# Altium schematic sheet Control_Interface.SchDoc
size A4; SheetNumber: 22; SheetTotal: 36
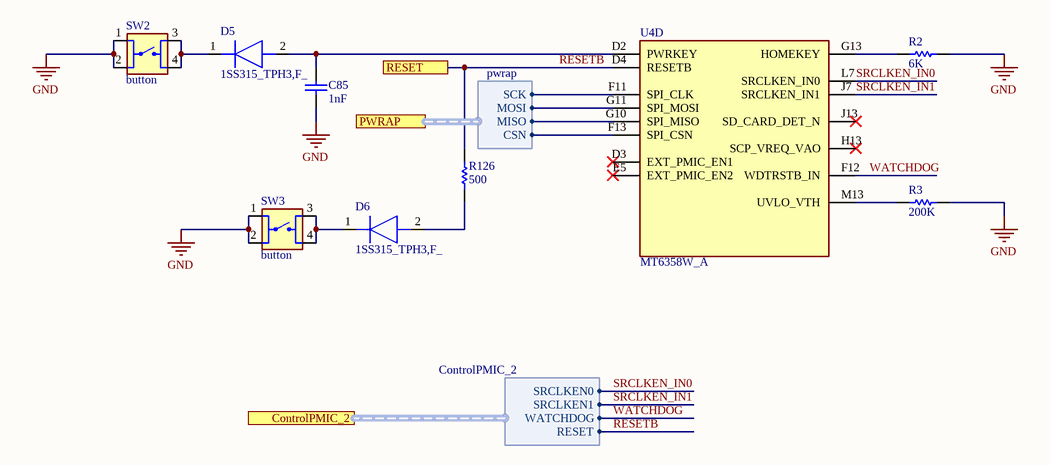
[diagram p0: Control_Interface.SchDoc]

## Parts
C85  value 1nF  [C0603]  (hidden comment: C0603)
D5  1SS315_TPH3,F_  [SOD2513X110N]
D6  1SS315_TPH3,F_  [SOD2513X110N]
R2  value 6K  [R0603]  (hidden comment: R0603)
R3  value 200K  [R0603]  (hidden comment: R0603)
R126  value 500  [R0603]  (hidden comment: R0603)
SW2  button  [BUTTON]
SW3  button  [BUTTON]
U4  MT6358W_A  [BGA194C40P16X15_640X600X66]  (part D of 6)

## Ports
ControlPMIC_2 (harness ControlPMIC_2, see Power[9700,8000], MT8365[11000,4800], MT8365_Other[1000,3700], Power[9700,9000]), PWRAP (harness pwrap, see Power[9100,8000], MT8365[5500,9000], MT8365_CONN[4500,8700], Power[9100,9000]), RESET (see Power[10000,7100], Power[11300,7100], RTL8201F[12800,5800], UART[1500,3000])

## Harnesses
pwrap: SCK, MOSI, MISO, CSN
ControlPMIC_2: WATCHDOG, SRCLKEN0, SRCLKEN1, RESET

## Nets
GND: C85.1 R2.2 R3.2 SW2.1 SW2.2 SW3.1 SW3.2
RESETB: R126.2 U4.D4(RESETB) ; port RESET, port ControlPMIC_2.RESET
SRCLKEN_IN0: U4.L7(SRCLKEN_IN0) ; port ControlPMIC_2.SRCLKEN0
SRCLKEN_IN1: U4.J7(SRCLKEN_IN1) ; port ControlPMIC_2.SRCLKEN1
WATCHDOG: U4.F12(WDTRSTB_IN) ; port ControlPMIC_2.WATCHDOG
NetC85_2: C85.2 D5.2(A) U4.D2(PWRKEY)
NetD5_1: D5.1(K) SW2.3 SW2.4
NetD6_1: D6.1(K) SW3.3 SW3.4
NetD6_2: D6.2(A) R126.1
NetR2_1: R2.1 U4.G13(HOMEKEY)
NetR3_1: R3.1 U4.M13(UVLO_VTH)
NetU4_F11: U4.F11(SPI_CLK) ; port PWRAP.SCK
NetU4_F13: U4.F13(SPI_CSN) ; port PWRAP.CSN
NetU4_G10: U4.G10(SPI_MISO) ; port PWRAP.MISO
NetU4_G11: U4.G11(SPI_MOSI) ; port PWRAP.MOSI

Not connected (* = marked no-connect by the designer): U4 D3(EXT_PMIC_EN1)* E5(EXT_PMIC_EN2)* H13(SCP_VREQ_VAO)* J13(SD_CARD_DET_N)*

## Library data of the parts
D5 D6 = 1SS315_TPH3,F_: Diode; Manufacturer_Name: Toshiba; Manufacturer_Part_Number: 1SS315(TPH3,F); Height: 1.1mm; Mouser Part Number: N/A; Mouser Price/Stock: https://www.mouser.co.uk/ProductDetail/Toshiba/1SS315TPH3F?qs=8TQFHmocP6xxNvZUFM2DpA%3D%3D
SW2 SW3 = button: 6x6 mm
U4 = MT6358W_A: Integrated Circuit; Manufacturer_Name: Mediatek; Manufacturer_Part_Number: MT6358W/A; Datasheet Link: https://www.mouser.com/catalog/specsheets/MediaTek_MTK_MT6358_Product_Brief_v1_0.pdf?_gl=1*14yevt7*_ga*OTAyMjU2NDU3LjE2ODExMDUyMzk.*_ga_1KQLCYKRX3*MTcwODA1NjU3MS4xMTcuMC4xNzA4MDU2NTczLjAuMC4w*_ga_15W4STQT4T*MTcwODA1NjU3Mi4xNzIuMC4xNzA4MDU2NTczLjU5LjAuMA..; Height: 0.66mm; Mouser Part Number: 840-MT6358W/A; Mouser Price/Stock: https://www.mouser.co.uk/ProductDetail/MediaTek/MT6358W-A?qs=Jm2GQyTW%2FbiK3FZkyfX0lQ%3D%3D